# Altium schematic sheet Connectors.SchDoc
size A4
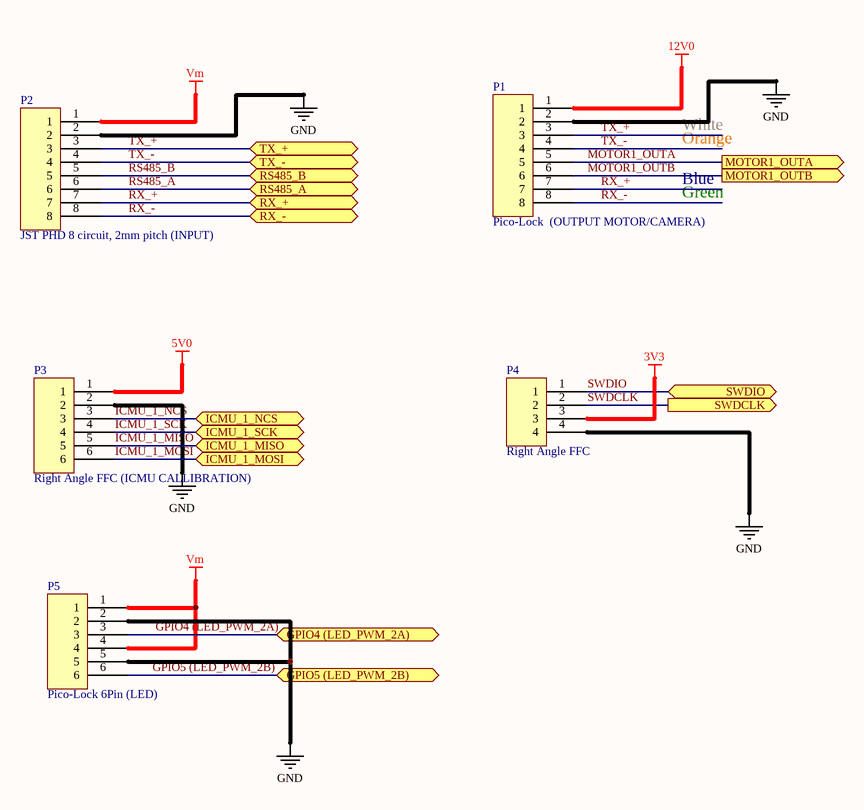
[diagram p0: Connectors.SchDoc]

## Parts
P1  Pico-Lock  (OUTPUT MOTOR/CAMERA)  [5040500891]
P2  JST PHD 8 circuit, 2mm pitch (INPUT)  [JST PHD connector]
P3  Right Angle FFC (ICMU CALLIBRATION)  [XF2W_0615_1A]
P4  Right Angle FFC  [XF2W_0415_1A]
P5  Pico-Lock 6Pin (LED)  [5040500691]

## Ports
GPIO4 (LED_PWM_2A) (bidir), GPIO5 (LED_PWM_2B) (bidir), ICMU_1_MISO (bidir), ICMU_1_MOSI (bidir), ICMU_1_NCS (bidir), ICMU_1_SCK (bidir), MOTOR1_OUTA (out), MOTOR1_OUTB (out), RS485_A (bidir), RS485_B (bidir), RX_+ (bidir), RX_- (bidir), SWDCLK (out), SWDIO (bidir), TX_+ (bidir), TX_- (bidir)

## Nets
3V3: P4.3
5V0: P3.1
12V0: P1.1
GND: P1.2 P2.2 P3.2 P4.4 P5.2 P5.5
Vm: P2.1 P5.1 P5.4
GPIO4 (LED_PWM_2A): P5.3 ; port GPIO4 (LED_PWM_2A)
GPIO5 (LED_PWM_2B): P5.6 ; port GPIO5 (LED_PWM_2B)
ICMU_1_MISO: P3.5 ; port ICMU_1_MISO
ICMU_1_MOSI: P3.6 ; port ICMU_1_MOSI
ICMU_1_NCS: P3.3 ; port ICMU_1_NCS
ICMU_1_SCK: P3.4 ; port ICMU_1_SCK
MOTOR1_OUTA: P1.5 ; port MOTOR1_OUTA
MOTOR1_OUTB: P1.6 ; port MOTOR1_OUTB
RS485_A: P2.6 ; port RS485_A
RS485_B: P2.5 ; port RS485_B
RX_+: P1.7 P2.7 ; port RX_+
RX_-: P1.8 P2.8 ; port RX_-
SWDCLK: P4.2 ; port SWDCLK
SWDIO: P4.1 ; port SWDIO
TX_+: P1.3 P2.3 ; port TX_+
TX_-: P1.4 P2.4 ; port TX_-

## Notes on the sheet
- Orange
- White
- Blue
- Green

## Library data of the parts
P1 = 5040500891: Pico-Lock 8 circuit, 1.5mm pitch; Manufacturer: Molex, LLC; Component Type: 8 Positions Header, Shrouded Connector 0.059" (1.50mm) Surface Mount, Right Angle Gold; Manufacturer Part Number: 5040500891; Price: 2.37; Supplier: Digi-Key; Supplier Part Number: WM14421CT-ND
P2 = S8B-PHDSS: JST PHD 8 circuit, 2mm pitch; Manufacturer Part Number: S8B-PHDSS(LF)(SN); Component Type: CONN HEADER PHD SIDE 8POS 2MM; Manufacturer: JST; Price: .63; Supplier: Digi-Key; Supplier Part Number: 455-2256-ND
P3 = XF2W-0615-1A: 6 pin FFC connector,0.5mm pitch, 0.5A; Manufacturer: Omron Electronics Inc-EMC Div; Component Type: 6 Position FPC Connector Contacts, Top and Bottom 0.020" (0.50mm) Surface Mount, Right Angle; Manufacturer Part Number: XF2W-0615-1A; Price: 1.41; Supplier: Digi-Key; Supplier Part Number: OR1190CT-ND
P4 = XF2W-0415-1A: 4 pin FFC connector,0.5mm pitch, 0.5A; Manufacturer: Omron Electronics Inc-EMC Div; Component Type: 4 Position FPC Connector Contacts, Top and Bottom 0.020" (0.50mm) Surface Mount, Right Angle; Manufacturer Part Number: XF2W-0415-1A; Supplier: Digi-Key; Supplier Part Number: OR1148CT-ND
P5 = 5040500691: Pico-Lock 5 circuit, 1.5mm pitch; Manufacturer: Molex, LLC; Component Type: 6 Positions Header, Shrouded Connector 0.059" (1.50mm) Surface Mount, Right Angle Gold; Manufacturer Part Number: 5040500691; Price: 2.06; Supplier: Digi-Key; Supplier Part Number: WM10143CT-ND